# EAGLE design display (EAGLE 6.4)
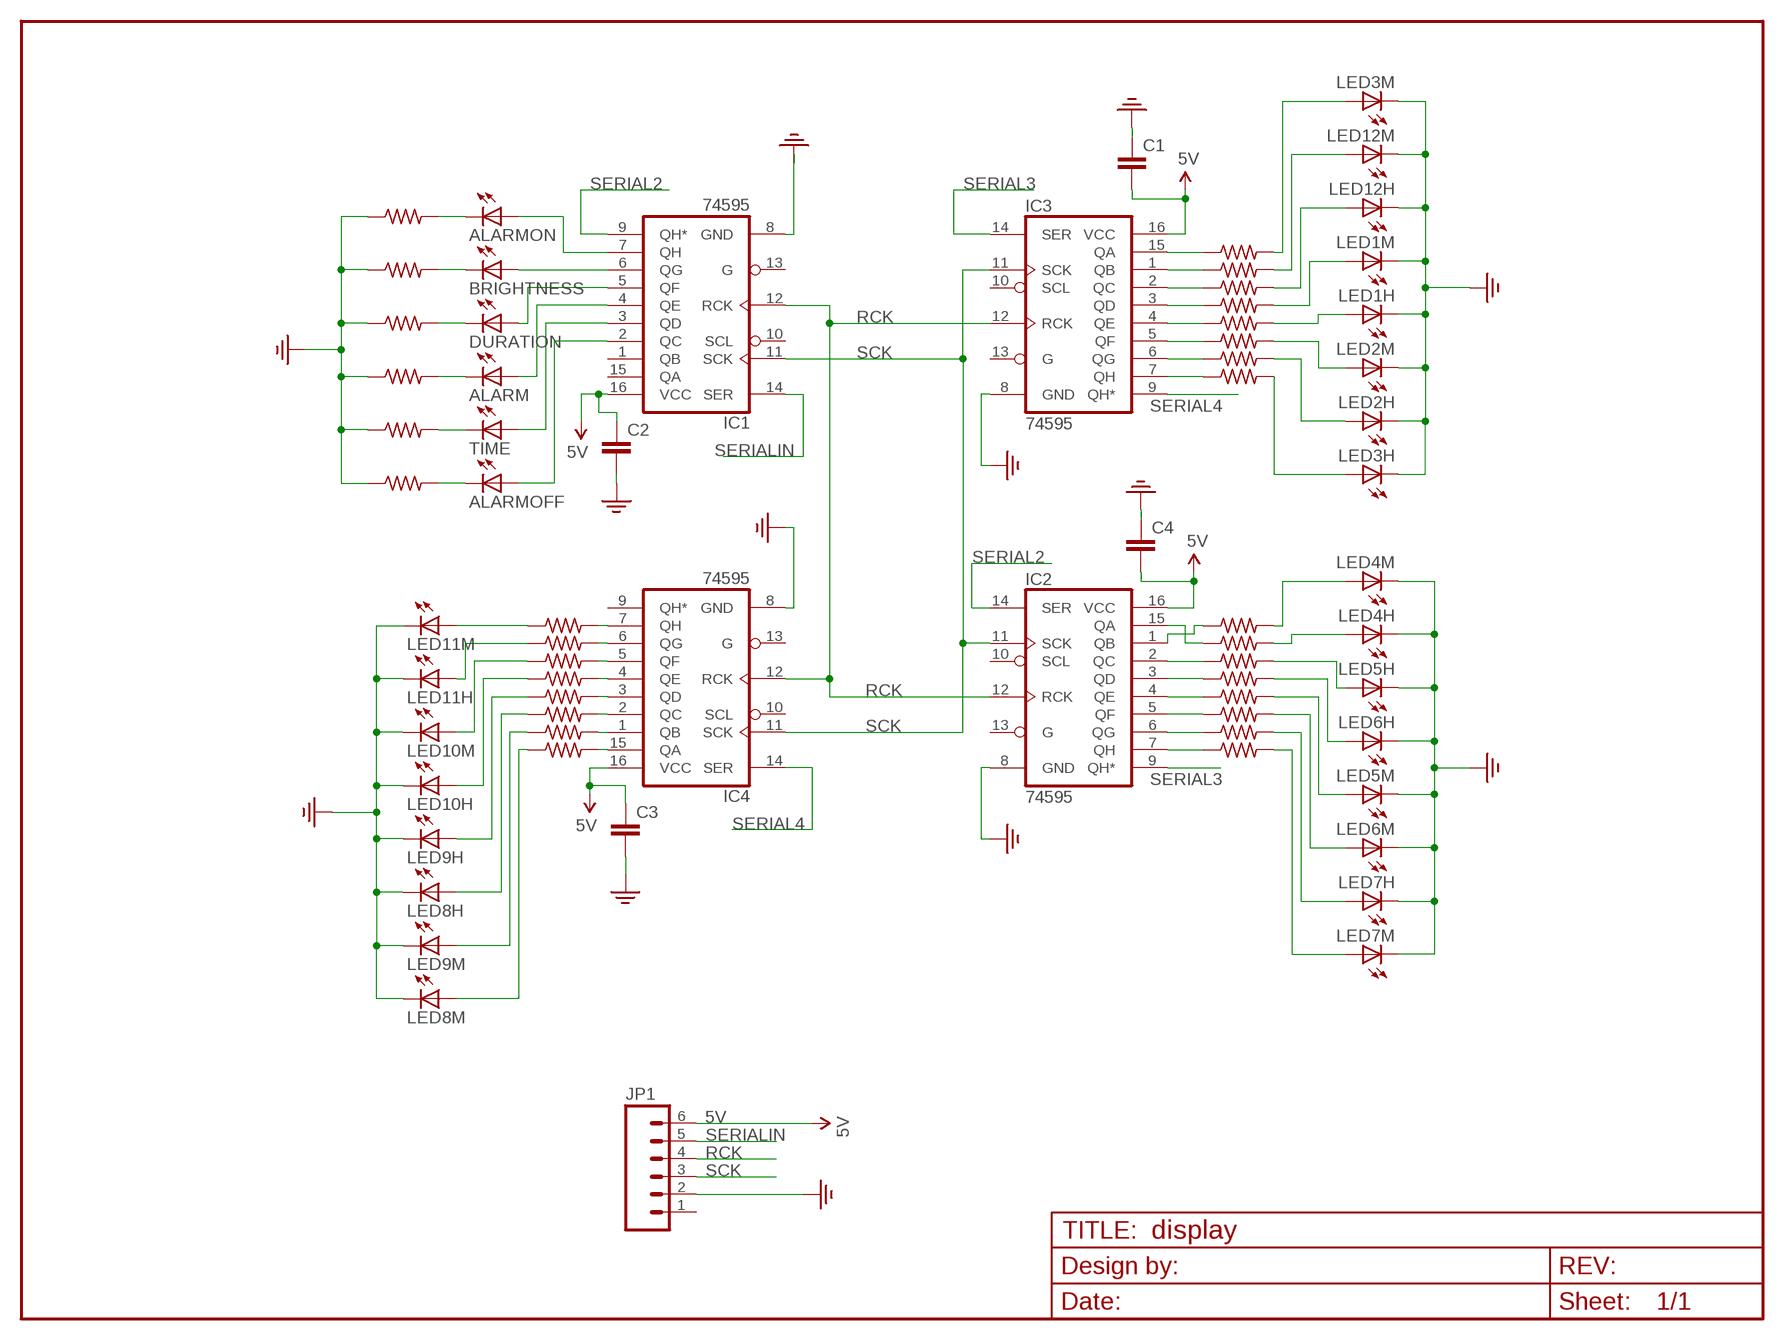
[diagram p0: schematic, sheet 1]

## Parts
ALARM  LED1206  [LED-1206]
ALARMOFF  LED1206  [LED-1206]
ALARMON  LED1206  [LED-1206]
BRIGHTNESS  LED1206  [LED-1206]
C1  CAP0805  [0805]
C2  CAP0805  [0805]
C3  CAP0805  [0805]
C4  CAP0805  [0805]
DURATION  LED1206  [LED-1206]
FRAME1  FRAME-LETTER  [CREATIVE_COMMONS]
IC1  74595  [TSSOP16]
IC2  74595  [TSSOP16]
IC3  74595  [TSSOP16]
IC4  74595  [TSSOP16]
JP1  M06SIP  [1X06]
LED1H  LED1206  [LED-1206]
LED1M  LED1206  [LED-1206]
LED2H  LED1206  [LED-1206]
LED2M  LED1206  [LED-1206]
LED3H  LED1206  [LED-1206]
LED3M  LED1206  [LED-1206]
LED4H  LED1206  [LED-1206]
LED4M  LED1206  [LED-1206]
LED5H  LED1206  [LED-1206]
LED5M  LED1206  [LED-1206]
LED6H  LED1206  [LED-1206]
LED6M  LED1206  [LED-1206]
LED7H  LED1206  [LED-1206]
LED7M  LED1206  [LED-1206]
LED8H  LED1206  [LED-1206]
LED8M  LED1206  [LED-1206]
LED9H  LED1206  [LED-1206]
LED9M  LED1206  [LED-1206]
LED10H  LED1206  [LED-1206]
LED10M  LED1206  [LED-1206]
LED11H  LED1206  [LED-1206]
LED11M  LED1206  [LED-1206]
LED12H  LED1206  [LED-1206]
LED12M  LED1206  [LED-1206]
TIME  LED1206  [LED-1206]
U$2  RESISTOR  [RESISTOR-0805]
U$3  RESISTOR  [RESISTOR-0805]
U$6  RESISTOR  [RESISTOR-0805]
U$7  RESISTOR  [RESISTOR-0805]
U$8  RESISTOR  [RESISTOR-0805]
U$9  RESISTOR  [RESISTOR-0805]
U$10  RESISTOR  [RESISTOR-0805]
U$11  RESISTOR  [RESISTOR-0805]
U$12  RESISTOR  [RESISTOR-0805]
U$13  RESISTOR  [RESISTOR-0805]
U$14  RESISTOR  [RESISTOR-0805]
U$15  RESISTOR  [RESISTOR-0805]
U$16  RESISTOR  [RESISTOR-0805]
U$17  RESISTOR  [RESISTOR-0805]
U$18  RESISTOR  [RESISTOR-0805]
U$19  RESISTOR  [RESISTOR-0805]
U$20  RESISTOR  [RESISTOR-0805]
U$21  RESISTOR  [RESISTOR-0805]
U$22  RESISTOR  [RESISTOR-0805]
U$23  RESISTOR  [RESISTOR-0805]
U$24  RESISTOR  [RESISTOR-0805]
U$25  RESISTOR  [RESISTOR-0805]
U$26  RESISTOR  [RESISTOR-0805]
U$27  RESISTOR  [RESISTOR-0805]
U$28  RESISTOR  [RESISTOR-0805]
U$29  RESISTOR  [RESISTOR-0805]
U$30  RESISTOR  [RESISTOR-0805]
U$31  RESISTOR  [RESISTOR-0805]
U$32  RESISTOR  [RESISTOR-0805]
U$33  RESISTOR  [RESISTOR-0805]

## Nets
5V: C1.2 C2.1 C3.1 C4.2 IC1.16(VCC) IC2.16(VCC) IC3.16(VCC) IC4.16(VCC) JP1.6
GND: C1.1 C2.2 C3.2 C4.1 IC1.8(GND) IC2.8(GND) IC3.8(GND) IC4.8(GND) JP1.2 LED1H.C LED1M.C LED2H.C LED2M.C LED3H.C LED3M.C LED4H.C LED4M.C LED5H.C LED5M.C LED6H.C LED6M.C LED7H.C LED7M.C LED8H.C LED8M.C LED9H.C LED9M.C LED10H.C LED10M.C LED11H.C LED11M.C LED12H.C LED12M.C U$24.1 U$25.1 U$30.1 U$31.1 U$32.1 U$33.1 ; supply symbol labelled GND2
N$1: LED12H.A U$8.2
N$2: LED12M.A U$7.2
N$3: LED1M.A U$9.2
N$4: LED1H.A U$10.2
N$5: LED2M.A U$11.2
N$6: LED3H.A U$12.2
N$7: LED2H.A U$13.2
N$8: LED3M.A U$6.2
N$9: IC2.2(QC) U$22.1
N$10: IC2.3(QD) U$23.1
N$11: IC2.4(QE) U$26.1
N$12: IC2.5(QF) U$27.1
N$13: IC2.15(QA) U$21.1
N$14: IC3.15(QA) U$6.1
N$15: LED4M.A U$20.2
N$16: IC2.1(QB) U$20.1
N$17: LED11M.A U$18.1
N$18: LED11H.A U$17.1
N$19: LED10M.A U$16.1
N$20: LED10H.A U$19.1
N$21: LED9H.A U$15.1
N$22: LED8H.A U$14.1
N$23: LED4H.A U$21.2
N$24: LED9M.A U$3.1
N$25: IC2.6(QG) U$28.1
N$26: IC2.7(QH) U$29.1
N$27: LED8M.A U$2.1
N$28: LED5H.A U$22.2
N$29: IC4.1(QB) U$3.2
N$30: IC4.15(QA) U$2.2
N$31: IC3.1(QB) U$7.1
N$32: IC3.2(QC) U$8.1
N$33: IC3.3(QD) U$9.1
N$34: IC3.4(QE) U$10.1
N$35: IC3.5(QF) U$11.1
N$36: IC3.6(QG) U$13.1
N$37: IC3.7(QH) U$12.1
N$38: IC4.7(QH) U$18.2
N$39: IC4.6(QG) U$17.2
N$40: IC4.5(QF) U$16.2
N$41: IC4.3(QD) U$15.2
N$42: IC4.2(QC) U$14.2
N$43: IC4.4(QE) U$19.2
N$44: LED6H.A U$23.2
N$45: LED5M.A U$26.2
N$46: LED6M.A U$27.2
N$47: LED7H.A U$28.2
N$48: LED7M.A U$29.2
N$49: ALARMON.A IC1.7(QH)
N$50: BRIGHTNESS.A IC1.6(QG)
N$52: ALARM.A IC1.4(QE)
N$53: IC1.3(QD) TIME.A
N$54: ALARMOFF.A IC1.2(QC)
N$55: ALARMOFF.C U$33.2
N$56: TIME.C U$32.2
N$57: ALARM.C U$31.2
N$58: DURATION.C U$30.2
N$59: BRIGHTNESS.C U$25.2
N$60: ALARMON.C U$24.2
N$63: DURATION.A IC1.5(QF)
RCK: IC1.12(RCK) IC2.12(RCK) IC3.12(RCK) IC4.12(RCK) JP1.4
SCK: IC1.11(SCK) IC2.11(SCK) IC3.11(SCK) IC4.11(SCK) JP1.3
SERIAL2: IC1.9(QH*) IC2.14(SER)
SERIAL3: IC2.9(QH*) IC3.14(SER)
SERIAL4: IC3.9(QH*) IC4.14(SER)
SERIALIN: IC1.14(SER) JP1.5
Unconnected: IC1.1(QB) IC1.10(SCL) IC1.13(G) IC1.15(QA) IC2.10(SCL) IC2.13(G) IC3.10(SCL) IC3.13(G) IC4.9(QH*) IC4.10(SCL) IC4.13(G) JP1.1

## Library data of the parts
ALARM ALARMOFF ALARMON BRIGHTNESS DURATION LED1H LED1M LED2H LED2M LED3H LED3M LED4H LED4M LED5H LED5M LED6H LED6M LED7H LED7M LED8H LED8M LED9H LED9M LED10H LED10M LED11H LED11M LED12H LED12M TIME = SparkFun-LED:LED: LEDs Standard schematic elements and footprints for 5mm, 3mm, 1206, and 0603 sized LEDs. 5mm - Spark Fun Electronics SKU : COM-00529 (and others)
C1-C4 = SparkFun-Passives:CAP: Capacitor Standard 0603 ceramic capacitor, and 0.1" leaded capacitor.
FRAME1 = SparkFun-Aesthetics:FRAME-LETTER: Schematic Frame Standard 8.5x11 US Letter frame
IC1-IC4 = SparkFun-DigitalIC:74*595: 8-bit SHIFT REGISTER, output latch
JP1 = SparkFun-Connectors:M06: Header 6 Standard 6-pin 0.1" header. Use with straight break away headers (SKU : PRT-00116), right angle break away headers (PRT-00553), swiss pins (PRT-00743), machine pins (PRT-00117), and female headers (PRT-00115). Molex polarized connector foot print use with SKU : PRT-08094 with associated crimp pins and housings. NOTES ON THE VARIANTS LOCK and LOCK_LONGPADS... This footprint was designed to help hold the alignment of a through-hole component (i.e. 6-pin header) while soldering it into place. You may notice that each hole has been shifted either up or down by 0.005 of an inch from it's more standard position (which is a perfectly straight line). This slight alteration caused the pins (the squares in the middle) to touch the edges of the holes. Because they are alternating, it causes a "brace" to hold the component in place. 0.005 has proven to be the perfect amount of "off-center" position when using our standard breakaway headers. Although looks a little odd when you look at the bare footprint, once you have a header in there, the alteration is very hard to notice. Also,if you push a header all the way into place, it is covered up entirely on the bottom side. This idea of altering the position of holes to aid alignment will be further integrated into the Sparkfun Library for other footprints. It can help hold any component with 3 or more connection pins.
U$2 U$3 U$6-U$33 = jt_parts:RESISTOR: Resistor footprints. 0805 modified from Adafruit library.

## Net classes
0 default: width 0.152 mm, clearance 0.152 mm

## Board
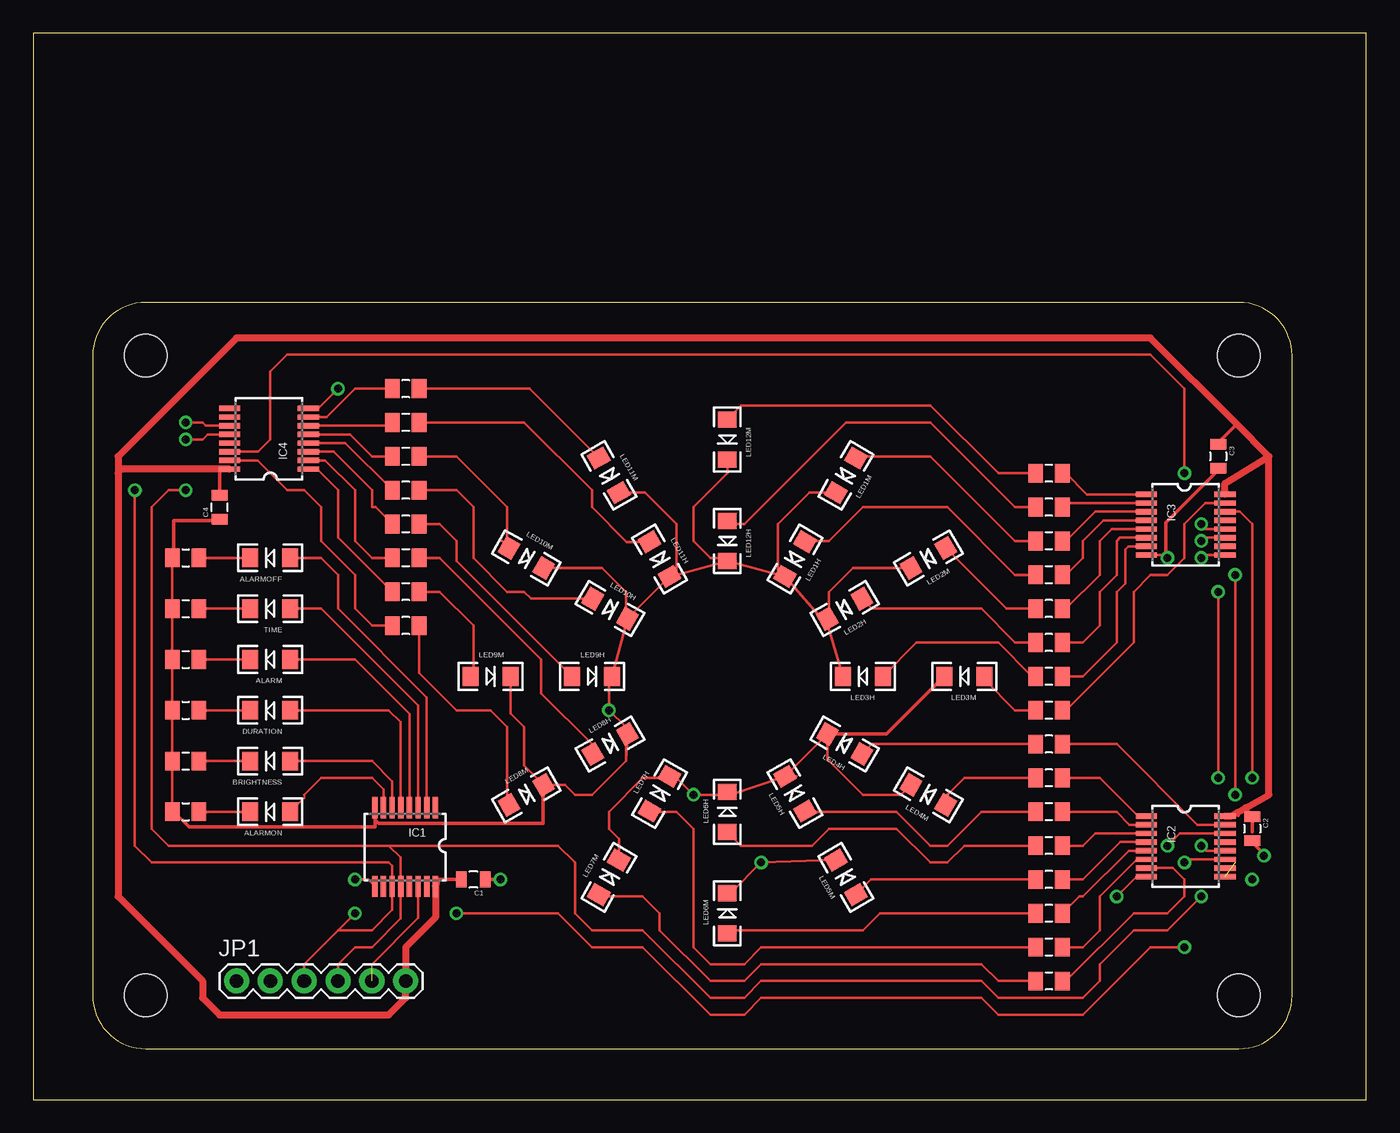
[diagram p1: board, top side]
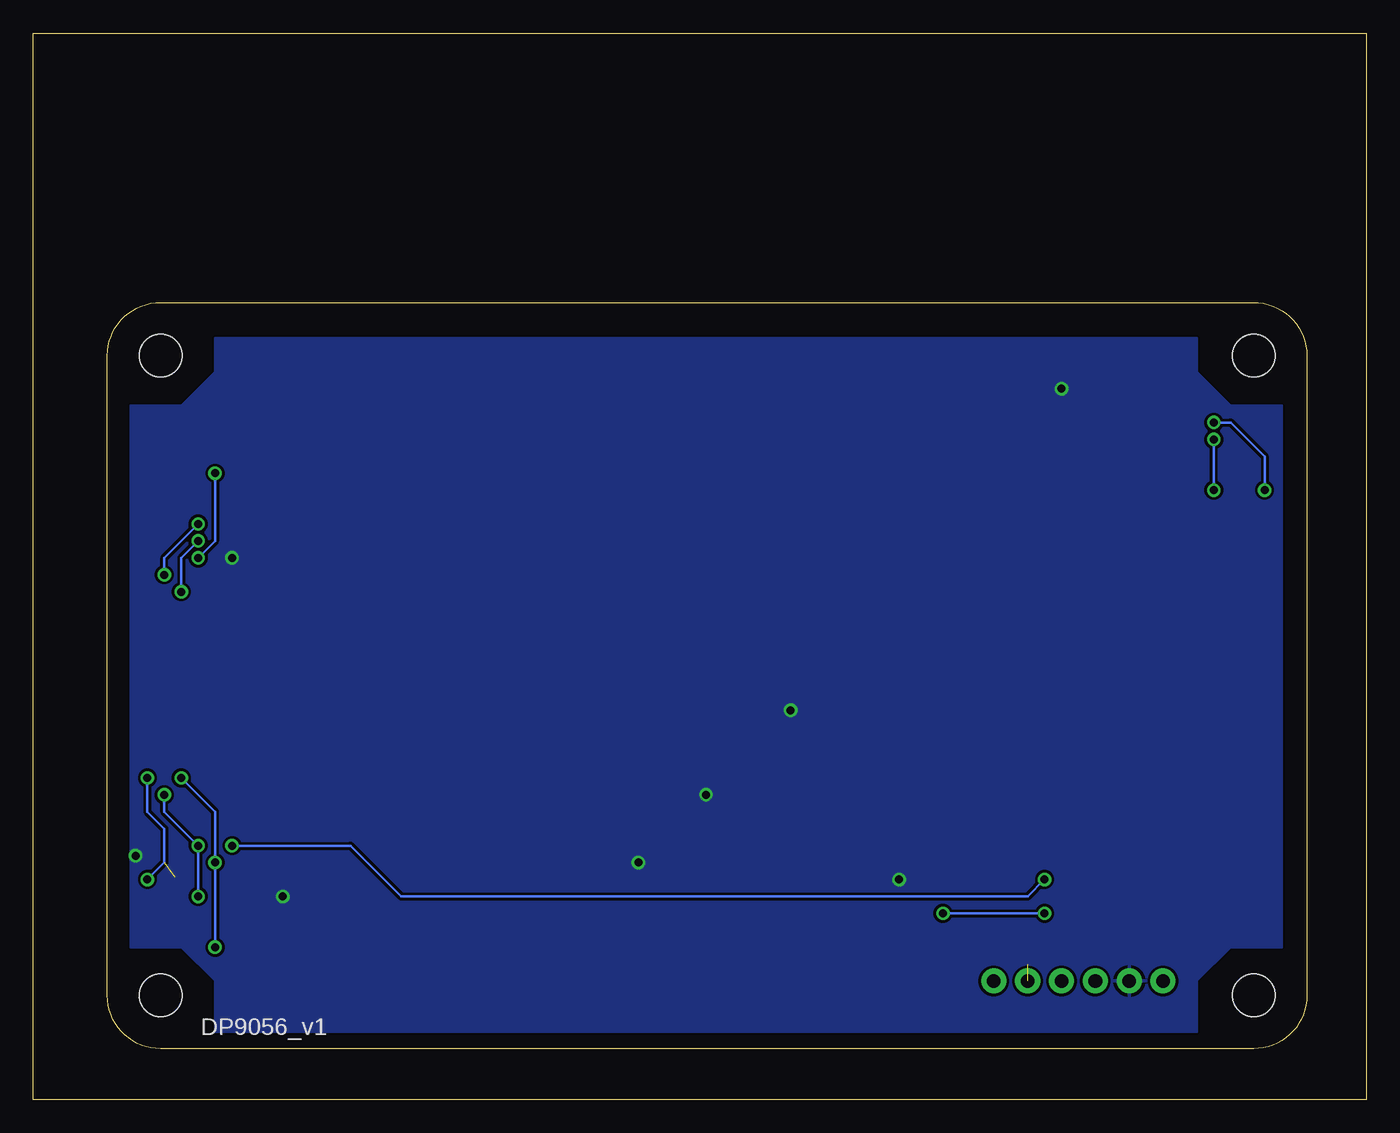
[diagram p2: board, bottom side, seen from below]

Size 100 x 80 mm. Coordinates in mm from the lower left corner, seen from the top.
Outline: 0,0 100,0 100,80 0,80 0,0
Copper layers (1*16): Top 0.035mm / dielectric 1.5mm / Bottom 0.035mm
Design rules "default": minimum track width 10mil, minimum drill 24mil, track to track 8mil, track to pad 8mil, pad to pad 8mil, via to via 8mil, smd to smd 8mil, copper to edge 40mil, drill to drill 8mil, minimum pad ring 10mil, minimum via ring 8mil, stop-mask expansion 4mil, vias tented up to drill 0mil, thermal gap 10mil

### Footprints (pad centres in the part's own frame; a part is rotated, then mirrored left to right if it is on the bottom)
LED-1206 = smd 1.2 x 1.4: A -1.5,0; C 1.5,0
0805 = smd 0.8 x 1.2: 1 -0.9,0; 2 0.9,0
TSSOP16 = smd 0.4 x 1.6: 1 -2.225,-2.85; 2 -1.575,-2.85; 3 -0.925,-2.85; 4 -0.275,-2.85; 5 0.375,-2.85; 6 1.025,-2.85; 7 1.675,-2.85; 8 2.325,-2.85; 9 2.325,3.05; 10 1.675,3.05; 11 1.025,3.05; 12 0.375,3.05; 13 -0.275,3.05; 14 -0.925,3.05; 15 -1.575,3.05; 16 -2.225,3.05
1X06 = drill 1.016 pad 1.88: 1 0,0; 2 2.54,0; 3 5.08,0; 4 7.62,0; 5 10.16,0; 6 12.7,0
DP9056_V1 = hole 3.2: 4,4; 86,4; 86,52; 4,52
RESISTOR-0805 = smd 1.1 x 1.4: 1 -1,0; 2 1,0

### Placement (x,y rotation side)
ALARM  17.78,33.02 180 top
ALARMOFF  17.78,40.64 180 top
ALARMON  17.78,21.59 180 top
BRIGHTNESS  17.78,25.4 180 top
C1  33.02,16.51 180 top
C2  91.44,20.32 270 top
C3  88.9,48.26 270 top
C4  13.97,44.45 90 top
DURATION  17.78,29.21 180 top
FRAME1  11.43,-12.7 0 top  (outside the outline)
IC1  27.94,19.05 180 top
IC2  86.36,19.05 270 top
IC3  86.36,43.18 270 top
IC4  17.78,49.53 90 top
JP1  15.24,8.89 0 top
LED1H  57.15,40.55 240 top
LED1M  60.96,46.83 240 top
LED2H  60.87,36.83 210 top
LED2M  67.15,40.64 210 top
LED3H  62.23,31.75 180 top
LED3M  69.85,31.75 180 top
LED4H  60.87,26.67 150 top
LED4M  67.15,22.86 150 top
LED5H  57.15,22.95 120 top
LED5M  60.96,16.67 120 top
LED6H  52.07,21.59 90 top
LED6M  52.07,13.97 90 top
LED7H  46.99,22.95 60 top
LED7M  43.18,16.67 60 top
LED8H  43.27,26.67 30 top
LED8M  36.99,22.86 30 top
LED9H  41.91,31.75 0 top
LED9M  34.29,31.75 0 top
LED10H  43.27,36.83 330 top
LED10M  36.99,40.64 330 top
LED11H  46.99,40.55 300 top
LED11M  43.18,46.83 300 top
LED12H  52.07,41.91 270 top
LED12M  52.07,49.53 270 top
TIME  17.78,36.83 180 top
U$1  [DP9056_V1]  4.45,3.81 0 top
U$2  27.94,35.56 180 top
U$3  27.94,38.1 180 top
U$6  76.2,29.21 180 top
U$7  76.2,46.99 180 top
U$8  76.2,44.45 180 top
U$9  76.2,41.91 180 top
U$10  76.2,39.37 180 top
U$11  76.2,36.83 180 top
U$12  76.2,31.75 180 top
U$13  76.2,34.29 180 top
U$14  27.94,40.64 180 top
U$15  27.94,43.18 180 top
U$16  27.94,48.26 180 top
U$17  27.94,50.8 180 top
U$18  27.94,53.34 180 top
U$19  27.94,45.72 180 top
U$20  76.2,24.13 180 top
U$21  76.2,26.67 180 top
U$22  76.2,21.59 180 top
U$23  76.2,19.05 180 top
U$24  11.43,21.59 0 top
U$25  11.43,25.4 0 top
U$26  76.2,16.51 180 top
U$27  76.2,13.97 180 top
U$28  76.2,11.43 180 top
U$29  76.2,8.89 180 top
U$30  11.43,29.21 0 top
U$31  11.43,33.02 0 top
U$32  11.43,36.83 0 top
U$33  11.43,40.64 0 top

### Tracks (layer width: path | path; a pad name or v marks a point on that pad's centre or on a via)
5V
  Top 0.203: 6.67,47.3 6.35,46.99
  Top 0.254: C1.2 30.35,16.51 30.35,16.13 IC1.16 | 91.44,20.07 C2.1 91.44,21.34 91.06,21.72 90.96,21.89 | 90.42,21.34 90.32,21.53 | 90.3,50.67 88.9,49.28 C3.1 | C4.2 13.97,47.12 IC4.16
  Top 0.508: IC2.16 89.86,21.27 90.32,21.53 90.96,21.89 92.71,22.86 92.71,48.26 | 92.71,48.26 90.3,50.67 83.82,57.15 15.24,57.15 6.35,48.26 6.35,46.99 6.35,15.24 12.7,8.89 12.7,7.62 13.97,6.35 26.67,6.35 27.94,7.62 JP1.6 27.94,11.43 30.16,13.65 IC1.16 | IC4.16 6.67,47.3 | IC3.16 89.41,46.23 92.71,48.26
GND  (via drill 0.6, 0.61)
  Top 0.203: LED9M.C 35.79,28.98 36.83,27.94 36.83,25.07 LED8M.C 39.89,23.61 40.64,22.86 41.91,22.86 44.45,25.4 | 44.45,27.3 LED8H.C 44.45,25.4 | LED11M.C 45.91,45.53 48.26,43.18 48.26,39.37 | LED12M.C 52.07,46.99 49.53,44.45 49.53,41.91 50.8,40.64 51.84,40.64 LED12H.C | LED2M.C 61.48,39.89 59.69,38.1 59.69,36.2 LED2H.C 59.57,35.68 59.61,35.54 | LED7M.C 43.93,19.57 43.18,20.32 43.18,21.59 45.72,24.13 47.62,24.13 | 47.62,24.13 LED7H.C | 60.96,31.98 LED3H.C 59.61,35.54 | LED11H.C 47.74,38.85 | 48.26,39.37 47.86,39.37 LED11H.C | LED5H.C 57.27,24.25 | LED5H.C 56,24.25 | U$24.1 U$25.1 U$30.1 U$31.1 U$32.1 U$33.1 | IC4.8 21.38,51.85 v22.86,53.34 | IC2.8 82.77,16.73 v81.28,15.24 | IC3.8 84.88,40.85 v85.09,40.64 | 54.8,17.97 v54.61,17.78 | LED6M.C 52.3,15.47 v54.61,17.78 | LED10H.C LED9H.C 43.18,31.52 v43.18,29.21 44.45,27.94 44.45,25.4 | LED10H.C LED11H.C | LED12H.C 48.26,39.37 | LED5H.C 52.3,22.86 LED6H.C 52.07,22.86 v49.53,22.86 48.26,24.13 47.62,24.13 | LED4M.C 65.1,22.86 62.23,22.86 59.57,25.52 LED4H.C LED5H.C | LED10M.C 42.66,39.89 44.45,38.1 44.45,36.2 LED10H.C | LED1M.C 58.23,45.53 55.88,43.18 55.88,39.77 LED1H.C | LED1H.C 59.61,35.54 | LED5M.C v54.61,17.78 | LED12H.C LED1H.C
  Top 0.254: LED3M.C 68.33,31.75 64.01,27.43 59.69,27.43 LED4H.C | 25.72,20.89 25.91,20.7 38.23,20.7 38.23,23.5 LED8M.C | 25.72,20.89 25.65,20.95 25.65,21.84 IC1.8 | v35.05,16.51 C1.1 | C3.2 88.9,47.24 84.96,43.31 84.96,40.89 v85.09,40.64 | C4.1 13.97,43.43 10.54,43.43 10.54,40.64 U$33.1 | U$24.1 10.54,21.59 11.68,20.45 25.65,20.45 25.65,20.83 25.72,20.89 | v92.33,18.29 92.33,18.41 91.44,19.3 C2.2
  pour Bottom: 6.35,52.07 10.16,52.07 12.7,54.61 12.7,57.15 86.36,57.15 86.36,54.61 88.9,52.07 92.71,52.07 92.71,11.43 88.9,11.43 86.36,8.89 86.36,5.08 12.7,5.08 12.7,8.89 10.16,11.43 6.35,11.43
N$1
  Top 0.203: U$8.2 73.66,44.45 67.31,50.8 60.96,50.8 53.34,43.18 52.3,43.18 LED12H.A
N$2
  Top 0.203: U$7.2 72.39,46.99 67.31,52.07 53.11,52.07 LED12M.A
N$3
  Top 0.203: U$9.2 73.66,41.91 67.31,48.26 61.84,48.26 LED1M.A
N$4
  Top 0.203: U$10.2 73.66,39.37 68.58,44.45 62.23,44.45 59.69,41.91 57.96,41.91 LED1H.A
N$5
  Top 0.203: U$11.2 73.01,36.83 LED2M.A
N$6
  Top 0.203: U$12.2 74.93,31.75 72.39,34.29 66.27,34.29 LED3H.A
N$7
  Top 0.203: U$13.2 73.66,34.29 71.12,36.83 62.92,36.83 LED2H.A
N$8
  Top 0.203: LED3M.A 71.35,31.52 73.66,29.21 U$6.2
N$9
  Top 0.203: IC2.2 82.25,20.62 81.28,21.59 U$22.1
N$10
  Top 0.203: IC2.3 79.67,19.98 78.74,19.05 U$23.1
N$11
  Top 0.203: IC2.4 81.56,19.32 78.74,16.51 U$26.1
N$12
  Top 0.203: IC2.5 82.17,18.68 78.74,15.24 78.47,15.24 U$27.1
N$13
  Top 0.203: IC2.15 87.33,20.62 81.28,26.67 U$21.1
N$14
  Top 0.203: U$6.1 77.47,29.21 82.55,34.29 82.55,38.1 83.82,39.37 85.09,39.37 86.36,40.64 86.36,43.18 87.94,44.76 IC3.15
N$15
  Top 0.203: U$20.2 69.85,24.13 68.58,22.86
  Top 0.254: 68.58,22.86 68.58,22.35 68.45,22.23 LED4M.A
N$16
  Top 0.203: IC2.1 82.86,21.27 80.01,24.13 U$20.1
N$17
  Top 0.203: U$18.1 37.22,53.34 LED11M.A
N$18
  Top 0.203: LED11H.A 44.51,41.85 41.91,44.45 41.91,45.72 36.83,50.8 U$17.1
N$19
  Top 0.203: 35.17,41.91 LED10M.A 35.56,41.52 35.56,44.45 31.75,48.26 U$16.1
N$20
  Top 0.203: LED10H.A 37.35,37.58 36.83,38.1 35.56,38.1 33.02,40.64 33.02,44.45 31.75,45.72 U$19.1
N$21
  Top 0.203: U$15.1 30.48,43.18 31.75,41.91 31.75,40.41 LED9H.A
N$22
  Top 0.203: U$14.1 30.48,40.64 38.1,33.02 38.1,30.48 41.91,26.67 41.91,25.98 LED8H.A
N$23
  Top 0.203: U$21.2 62.92,26.67 LED4H.A
N$24
  Top 0.203: U$3.1 30.48,38.1 33.02,35.56 33.02,31.98 LED9M.A
N$25
  Top 0.203: IC2.6 82.8,18.02 80.01,15.24 80.01,12.7 78.74,11.43 U$28.1
N$26
  Top 0.203: IC2.7 85.5,17.38 86.36,16.51 86.36,15.24 85.09,13.97 82.55,13.97 77.47,8.89 U$29.1
N$27
  Top 0.203: U$2.1 28.94,32.02 31.75,29.21 34.29,29.21 35.56,27.94 35.56,22.24 LED8M.A
N$28
  Top 0.203: U$22.2 71.12,21.59 68.58,19.05 67.31,19.05 64.77,21.59 57.96,21.59 LED5H.A
N$29
  Top 0.203: IC4.1 21.27,47.3 22.86,45.72 22.86,42.18 U$3.2
N$30
  Top 0.203: IC4.15 16.82,47.95 19.05,45.72 20.32,45.72 21.59,44.45 21.59,41.91 24.13,39.37 24.13,36.83 25.4,35.56 U$2.2
N$31
  Top 0.203: IC3.1 79.06,45.41 77.47,46.99 U$7.1
N$32
  Top 0.203: IC3.2 77.5,44.76 U$8.1
N$33
  Top 0.203: IC3.3 79.67,44.1 77.47,41.91 U$9.1
N$34
  Top 0.203: IC3.4 80.28,43.45 78.74,41.91 78.74,40.64 77.47,39.37 U$10.1
N$35
  Top 0.203: IC3.5 80.91,42.8 80.01,41.91 80.01,39.37 77.47,36.83 U$11.1
N$36
  Top 0.203: IC3.6 81.53,42.16 81.28,41.91 81.28,39.37 80.01,38.1 80.01,35.56 78.74,34.29 U$13.1
N$37
  Top 0.203: IC3.7 82.14,41.51 81.92,41.27 81.92,38.73 81.28,38.1 81.28,34.29 78.74,31.75 U$12.1
N$38
  Top 0.203: IC4.7 22,51.2 24.13,53.34 U$18.2
N$39
  Top 0.203: IC4.6 26.7,50.55 U$17.2
N$40
  Top 0.203: IC4.5 23.75,49.91 25.4,48.26 U$16.2
N$41
  Top 0.203: IC4.3 22.52,48.6 25.4,45.72 25.4,44.45 25.67,44.45 U$15.2
N$42
  Top 0.203: IC4.2 21.89,47.95 24.13,45.72 24.13,41.91 25.4,40.64 U$14.2 26.67,40.64
N$43
  Top 0.203: IC4.4 23.41,49.26 U$19.2
N$44
  Top 0.203: U$23.2 69.85,19.05 68.58,17.78 67.31,17.78 64.77,20.32 59.69,20.32 58.42,19.05 53.11,19.05 LED6H.A
N$45
  Top 0.203: U$26.2 62.85,16.51 LED5M.A
N$46
  Top 0.203: U$27.2 63.5,13.97 62.23,12.7 52.3,12.7 LED6M.A
N$47
  Top 0.203: U$28.2 54.61,11.43 53.34,10.16 50.8,10.16 49.53,11.43 49.53,20.32 48.26,21.59 46.3,21.59 LED7H.A
N$48
  Top 0.203: U$29.2 72.39,8.89 71.12,10.16 54.61,10.16 53.34,8.89 50.8,8.89 46.99,12.7 46.99,13.97 45.72,15.24 42.56,15.24 LED7M.A
N$49
  Top 0.152: 20.32,22.86 20.32,22.63 ALARMON.A
  Top 0.203: IC1.7 26.27,23.27 25.4,24.13 21.59,24.13 20.32,22.86
N$50
  Top 0.203: IC1.6 26.91,23.89 25.4,25.4 BRIGHTNESS.A
N$52
  Top 0.203: IC1.4 28.21,28.93 24.13,33.02 ALARM.A
N$53
  Top 0.203: IC1.3 28.86,29.55 21.59,36.83 TIME.A
N$54
  Top 0.152: ALARMOFF.A 19.05,40.64
  Top 0.203: IC1.2 29.52,30.18 22.86,36.83 22.86,39.37 21.59,40.64 ALARMOFF.A
N$55
  Top 0.203: ALARMOFF.C U$33.2
N$56
  Top 0.203: TIME.C U$32.2
N$57
  Top 0.203: U$31.2 ALARM.C
N$58
  Top 0.203: DURATION.C U$30.2
N$59
  Top 0.203: U$25.2 BRIGHTNESS.C
N$60
  Top 0.203: ALARMON.C U$24.2
N$63
  Top 0.203: IC1.5 27.57,28.32 26.67,29.21 DURATION.A
RCK  (via drill 0.6 pad 0.51)
  Top 0.203: JP1.4 22.86,10.16 24.13,11.43 25.4,11.43 27.57,13.6 IC1.12 27.57,18.16 26.67,19.05 | 26.67,19.05 10.16,19.05 8.89,20.32 8.89,44.45 10.16,45.72 v11.43,45.72 | IC4.12 13.07,49.91 12.7,49.53 v11.43,49.53 | IC3.12 88,42.8 v87.63,43.18 | IC2.12 88,18.68 v87.63,19.05 | v90.17,22.86 v90.17,39.37 | v87.63,15.24 85.09,12.7 82.55,12.7 80.01,10.16 80.01,8.89 78.74,7.62 72.39,7.62 71.12,8.89 54.61,8.89 53.34,7.62 50.8,7.62 45.72,12.7 41.91,12.7 40.64,13.97 40.64,17.78 39.37,19.05 26.67,19.05
  Bottom 0.203: v11.43,45.72 v11.43,49.53 | v90.17,22.86 90.17,21.59 v87.63,19.05 v87.63,15.24 | v90.17,39.37 90.17,40.64 v87.63,43.18
SCK  (via drill 0.6 pad 0.51)
  Top 0.203: 22.86,12.7 25.4,12.7 26.91,14.21 IC1.11 26.91,17.54 26.67,17.78 8.89,17.78 7.62,19.05 v7.62,45.72 | JP1.3 20.32,10.16 22.86,12.7 | IC4.11 12.95,50.55 12.7,50.8 v11.43,50.8 | IC3.11 87.88,42.16 v87.63,41.91 | IC2.11 86.61,18.02 v86.36,17.78 | v88.9,24.13 v88.9,38.1 | 22.86,12.7 v24.13,13.97 | v86.36,11.43 83.82,11.43 78.74,6.35 72.39,6.35 71.12,7.62 54.61,7.62 53.34,6.35 50.8,6.35 45.72,11.43 41.91,11.43 39.37,13.97 v31.75,13.97
  Bottom 0.203: v11.43,50.8 10.16,50.8 7.62,48.26 v7.62,45.72 | v88.9,24.13 86.36,21.59 v86.36,17.78 v86.36,11.43 | v87.63,41.91 88.9,40.64 v88.9,38.1 | v31.75,13.97 v24.13,13.97
SERIAL2  (via drill 0.6)
  Top 0.203: IC2.14 86.02,19.98 v85.09,19.05 | v24.13,16.51 25.11,16.51 IC1.9
  Bottom 0.203: v85.09,19.05 76.2,19.05 72.39,15.24 25.4,15.24 v24.13,16.51
SERIAL3  (via drill 0.6 pad 0.51)  (1 unrouted)
  Top 0.203: IC3.14 90.52,44.1 91.44,43.18 v91.44,24.13 | 91.22,16.73 v91.44,16.51
  Bottom 0.203: v91.44,24.13 91.44,21.59 90.17,20.32 90.17,17.78 v91.44,16.51
SERIAL4  (via drill 0.6 pad 0.51)
  Top 0.203: IC4.14 16.86,48.6 17.78,49.53 17.78,54.61 19.05,55.88 83.82,55.88 86.36,53.34 v86.36,46.99 | IC3.9 87.84,40.85 v87.63,40.64
  Bottom 0.203: v86.36,46.99 86.36,41.91 v87.63,40.64
SERIALIN  (1 unrouted)
  Top 0.203: IC1.14 28.86,13.62 25.4,10.16